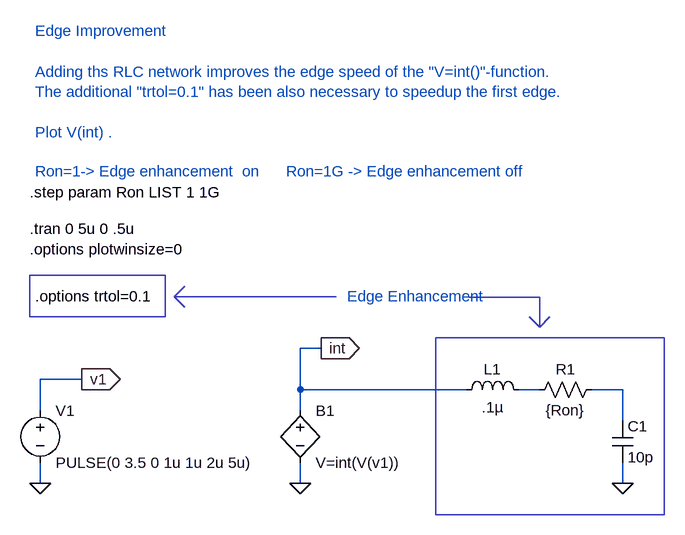
[diagram p0: schematic Edge_enhancement1.asc]
Edge_enhancement1.asc, the LTspice schematic file:
Version 4
SHEET 1 980 680
WIRE -112 144 -112 96
WIRE -112 256 -112 224
WIRE -48 96 -112 96
WIRE 288 112 288 48
WIRE 288 144 288 112
WIRE 288 256 288 224
WIRE 320 48 288 48
WIRE 544 112 288 112
WIRE 656 112 624 112
WIRE 784 112 736 112
WIRE 784 160 784 112
WIRE 784 256 784 224
FLAG 288 256 0
FLAG -112 256 0
FLAG -48 96 v1
IOPIN -48 96 Out
FLAG 320 48 int
IOPIN 320 48 Out
FLAG 784 256 0
SYMBOL voltage -112 128 R0
WINDOW 123 0 0 Left 0
WINDOW 39 0 0 Left 0
SYMATTR InstName V1
SYMATTR Value PULSE(0 3.5 0 1u 1u 2u 5u)
SYMBOL bv 288 128 R0
SYMATTR InstName B1
SYMATTR Value V=int(V(v1))
SYMBOL cap 768 160 R0
SYMATTR InstName C1
SYMATTR Value 10p
SYMBOL res 640 128 R270
WINDOW 0 32 56 VTop 0
WINDOW 3 0 56 VBottom 0
SYMATTR InstName R1
SYMATTR Value {Ron}
SYMBOL ind 528 128 R270
WINDOW 0 32 56 VTop 0
WINDOW 3 5 56 VBottom 0
SYMATTR InstName L1
SYMATTR Value .1µ
TEXT -128 -136 Left 0 !.tran 0 5u 0 .5u
TEXT -128 -104 Left 0 !.options plotwinsize=0
TEXT -120 -32 Left 0 !.options trtol=0.1
TEXT -128 -192 Left 0 !.step param Ron LIST 1 1G
TEXT -120 -440 Left 0 ;Edge Improvement\n \nAdding ths RLC network improves the edge speed of the "V=int()"-function.\nThe additional "trtol=0.1" has been also necessary to speedup the first edge.\n \nPlot V(int) .
TEXT 360 -32 Left 0 ;Edge Enhancement
TEXT -120 -224 Left 0 ;Ron=1-> Edge enhancement  on      Ron=1G -> Edge enhancement off
LINE Normal 656 -30 548 -30
LINE Normal 656 16 656 -30
LINE Normal 672 0 656 16
LINE Normal 640 0 656 16
LINE Normal 94 -31 343 -31
LINE Normal 110 -47 94 -31
LINE Normal 110 -15 94 -31
RECTANGLE Normal 848 304 496 32
RECTANGLE Normal 80 0 -128 -64

The netlist it stands for:
* Edge_enhancement1.asc
V1 v1 0 PULSE(0 3.5 0 1u 1u 2u 5u)
B1 int 0 V=int(V(v1))
C1 N002 0 10p
R1 N001 N002 {Ron}
L1 int N001 .1µ
.tran 0 5u 0 .5u
.options plotwinsize=0
.options trtol=0.1
.step param Ron LIST 1 1G
* Edge Improvement
* Adding ths RLC network improves the edge speed of the "V=int()"-function.
* The additional "trtol=0.1" has been also necessary to speedup the first edge.
* Plot V(int) .
* Edge Enhancement
* Ron=1-> Edge enhancement  on      Ron=1G -> Edge enhancement off
.backanno
.end